# Altium project MB1936.PrjPcb (part 1 of 8)
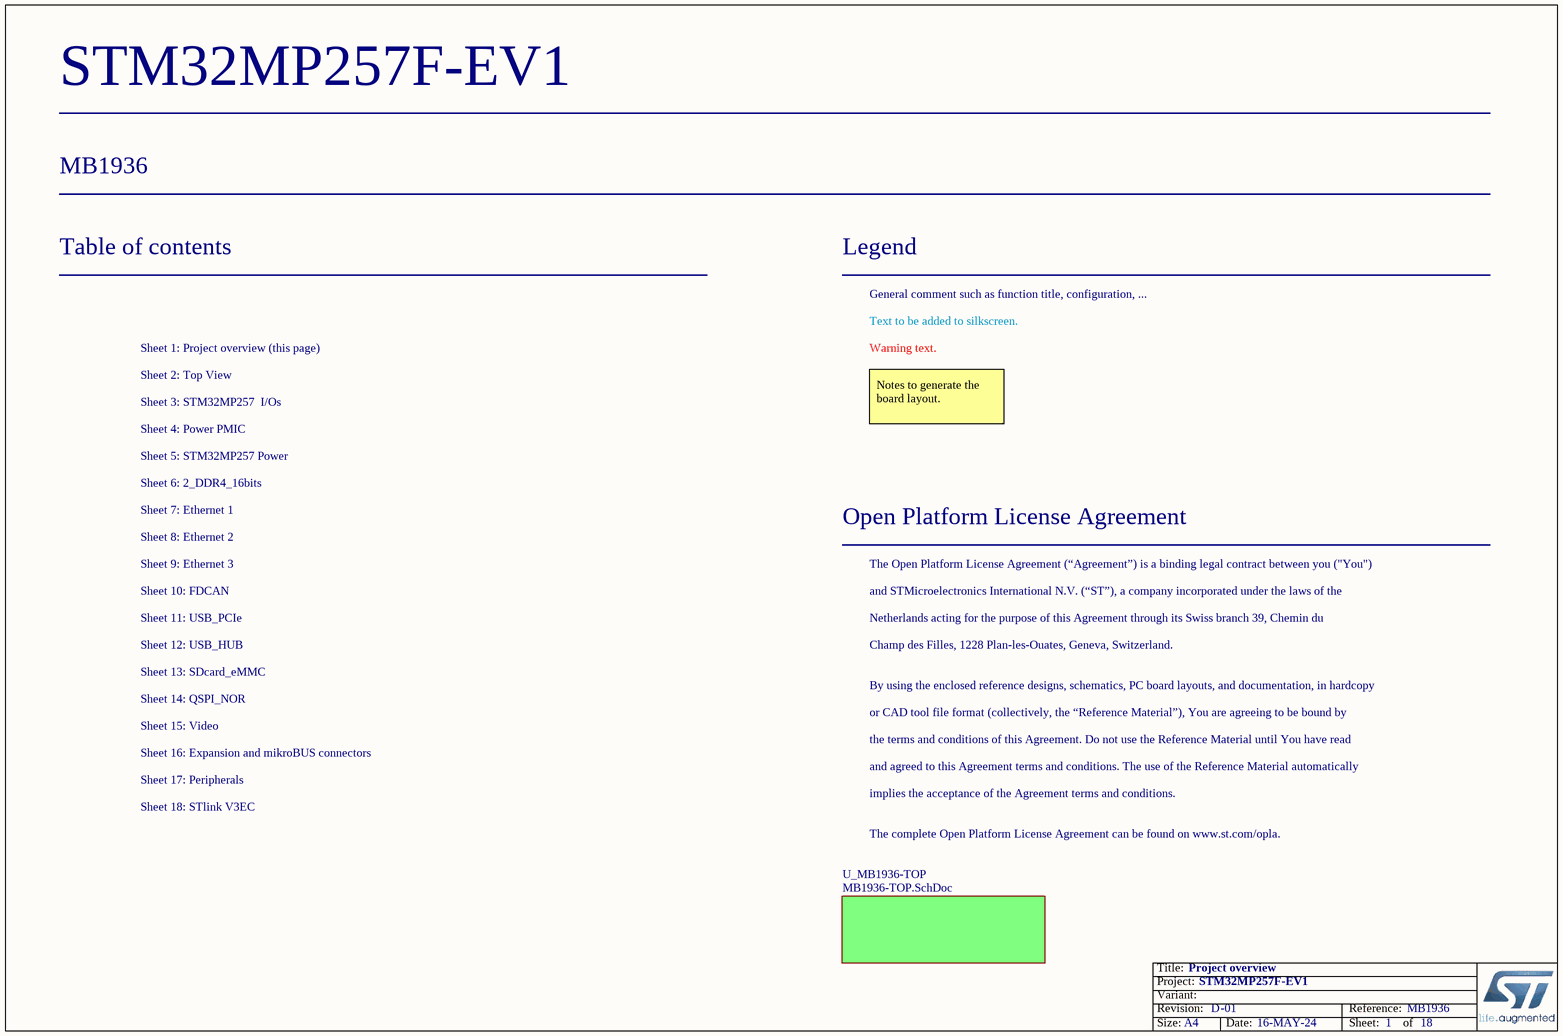
[diagram p0: MB1936_Project_Overview.SchDoc]
Board_Reference: MB1936; Board_PCB_Revision: D; Board_Name: STM32MP257F-EV1; Board_Document_Date: 16-MAY-24; Board_Assembly_Revision: 01
18 sheets, 865 parts. Net scope: flat (ports and power ports of the same name join across sheets).
Board file: MB1936.PcbDoc
Sheets:
  MB1936_Project_Overview.SchDoc
    U_MB1936-TOP = MB1936-TOP.SchDoc
      U_Video = Video.SchDoc
      U_SDcard_eMMC = SDcard_eMMC.SchDoc
      U_MP257_18x18 = MP257_18x18.SchDoc
      U_FDCAN = FDCAN.SchDoc
      U_Ethernet1 = Ethernet1.SchDoc
      U_Ethernet2 = Ethernet2.SchDoc
      U_Ethernet3 = Ethernet3.SchDoc
      U_Peripherals = Peripherals.SchDoc
      U_QSPI_NOR = QSPI_NOR.SchDoc
      U_Power_MPU = Power_MPU.SchDoc
      U_USB_HUB = USB_HUB.SchDoc
      U_2_DDR4_16bits = 2_DDR4_16bits.SchDoc
      U_USB_PCIe = USB_PCIe.SchDoc
      U_STLINK_V3EC = STLINK_V3EC.SchDoc
      U_Power_PMIC = Power_PMIC.SchDoc
      U_Expansion _&_mikroBUS_Connectors = Expansion _&_mikroBUS_Connectors.SchDoc

## Sheet MB1936_Project_Overview.SchDoc: Project overview
size A4; Date: Not used; ApprovedBy: Not used; CheckedBy: Not used; Author: Not used; CompanyName: STMicroelectronics; DrawnBy: Not used; Engineer: Not used; Organization: Not used; Address1: Not used; Address2: Not used; Address3: Not used; Address4: Not used; DocumentNumber: Not used; Revision: Not used; SheetNumber: 1; SheetTotal: 18; CurrentTime: Not used; CurrentDate: Not used; Time: Not used; DocumentFullPathAndName: Not used; DocumentName: Not used; ModifiedDate: Not used; ImagePath: Not used; ProjectName: Not used; Application_BuildNumber: Not used

### Sub-sheets
U_MB1936-TOP = MB1936-TOP.SchDoc: no entries

### Notes on the sheet
- Table of contents
- Legend
- General comment such as function title, configuration, ...
- Sheet 1: Project overview (this page)
- Sheet 2: Top View
- Text to be added to silkscreen.
- Warning text.
- Sheet 3: STM32MP257  I/Os
- Sheet 4: Power PMIC
- Notes to generate the board layout.
- Sheet 5: STM32MP257 Power
- Sheet 7: Ethernet 1
- Sheet 6: 2_DDR4_16bits
- Sheet 8: Ethernet 2
- Sheet 9: Ethernet 3
- Open Platform License Agreement
- The Open Platform License Agreement (“Agreement”) is a binding legal contract between you ("You")
- Sheet 10: FDCAN
- Sheet 11: USB_PCIe
- Sheet 12: USB_HUB
- and STMicroelectronics International N.V. (“ST”), a company incorporated under the laws of the
- Netherlands acting for the purpose of this Agreement through its Swiss branch 39, Chemin du
- Champ des Filles, 1228 Plan-les-Ouates, Geneva, Switzerland.
- Sheet 13: SDcard_eMMC
- Sheet 14: QSPI_NOR
- By using the enclosed reference designs, schematics, PC board layouts, and documentation, in hardcopy
- or CAD tool file format (collectively, the “Reference Material”), You are agreeing to be bound by
- Sheet 17: Peripherals
- Sheet 16: Expansion and mikroBUS connectors
- Sheet 15: Video
- the terms and conditions of this Agreement. Do not use the Reference Material until You have read
- and agreed to this Agreement terms and conditions. The use of the Reference Material automatically
- Sheet 18: STlink V3EC
- implies the acceptance of the Agreement terms and conditions.
- The complete Open Platform License Agreement can be found on www.st.com/opla.
- Title:
- Project:
- Size:
- Revision:
- Variant:
- A4
- -
- Date:
- Reference:
- Sheet:
- of

## Sheet MB1936-TOP.SchDoc: TOP
size A3; Date: Not used; ApprovedBy: Not used; CheckedBy: Not used; Author: Not used; CompanyName: STMicroelectronics; DrawnBy: Not used; Engineer: Not used; Organization: Not used; Address1: Not used; Address2: Not used; Address3: Not used; Address4: Not used; DocumentNumber: Not used; Revision: Not used; SheetNumber: 2; SheetTotal: 18; CurrentTime: Not used; CurrentDate: Not used; Time: Not used; DocumentFullPathAndName: Not used; DocumentName: Not used; ModifiedDate: Not used; ImagePath: Not used; ProjectName: Not used; Application_BuildNumber: Not used
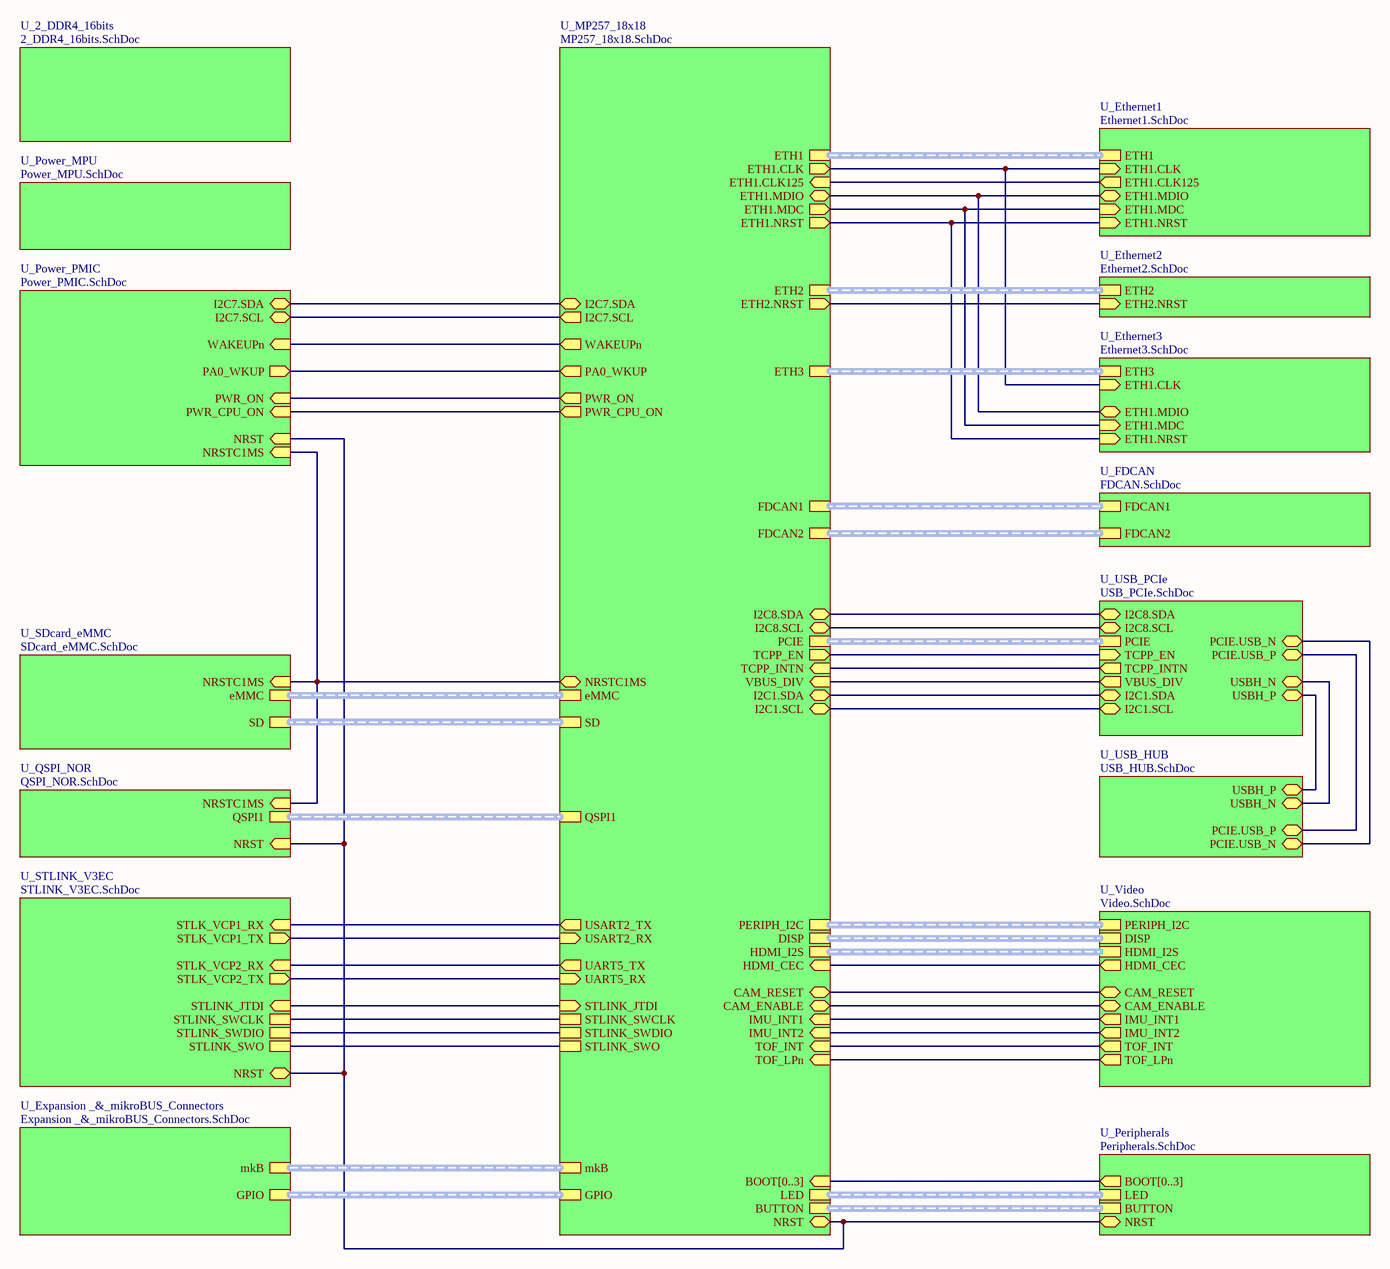
[diagram p1: MB1936-TOP.SchDoc]

### Sub-sheets
U_2_DDR4_16bits = 2_DDR4_16bits.SchDoc: no entries
U_Ethernet1 = Ethernet1.SchDoc: ETH1.NRST (in), ETH1 (harness ETH1), ETH1.CLK (in), ETH1.MDC (in), ETH1.MDIO (bidir), ETH1.CLK125 (out)
U_Ethernet2 = Ethernet2.SchDoc: ETH2.NRST (in), ETH2 (harness ETH2)
U_Ethernet3 = Ethernet3.SchDoc: ETH1.NRST (in), ETH3 (harness ETH3), ETH1.CLK (in), ETH1.MDIO (bidir), ETH1.MDC (in)
U_Expansion _&_mikroBUS_Connectors = Expansion _&_mikroBUS_Connectors.SchDoc: GPIO (harness GPIO), mkB (harness mikroBUS)
U_FDCAN = FDCAN.SchDoc: FDCAN2 (harness FDCAN2), FDCAN1 (harness FDCAN1)
U_MP257_18x18 = MP257_18x18.SchDoc: SD (harness SD), eMMC (harness eMMC), ETH1 (harness ETH1), ETH3 (harness ETH3), HDMI_CEC (in), ETH2 (harness ETH2), ETH1.NRST (out), PWR_ON (out), NRST (bidir), FDCAN1 (harness FDCAN1), FDCAN2 (harness FDCAN2), LED (harness LED), BOOT[0..3] (in), UART5_RX (in), UART5_TX (out), QSPI1 (harness QSPI), GPIO (harness GPIO), HDMI_I2S (harness HDMI_I2S), PERIPH_I2C (harness PERIPH_I2C), TCPP_INTN (in), I2C7.SDA (bidir), USART2_TX (out), I2C7.SCL (out), USART2_RX (in), VBUS_DIV (in), ETH1.MDIO (bidir), ETH1.CLK125 (in), ETH1.MDC (out), ETH1.CLK (out), PCIE (harness PCIE), STLINK_JTDI (in), STLINK_SWCLK, STLINK_SWDIO, STLINK_SWO, DISP (harness DISP), I2C1.SDA (bidir), I2C1.SCL (bidir), NRSTC1MS (bidir), PWR_CPU_ON (out), TOF_INT (in), CAM_ENABLE (bidir), IMU_INT1 (in), IMU_INT2 (in), TOF_LPn (in), CAM_RESET (bidir), ETH2.NRST (out), I2C8.SDA (bidir), I2C8.SCL (bidir), BUTTON (harness BUTTON), PA0_WKUP (out), WAKEUPn (out), mkB (harness mikroBUS), TCPP_EN (out)
U_Peripherals = Peripherals.SchDoc: NRST (bidir), BOOT[0..3] (out), LED (harness LED), BUTTON (harness BUTTON)
U_Power_MPU = Power_MPU.SchDoc: no entries
U_Power_PMIC = Power_PMIC.SchDoc: PWR_CPU_ON (in), NRST (in), PWR_ON (in), I2C7.SDA (bidir), I2C7.SCL (bidir), WAKEUPn (in), NRSTC1MS (in), PA0_WKUP (out)
U_QSPI_NOR = QSPI_NOR.SchDoc: QSPI1 (harness QSPI), NRSTC1MS (in), NRST (in)
U_SDcard_eMMC = SDcard_eMMC.SchDoc: SD (harness SD), NRSTC1MS (in), eMMC (harness eMMC)
U_STLINK_V3EC = STLINK_V3EC.SchDoc: NRST (bidir), STLK_VCP2_TX (out), STLK_VCP2_RX (in), STLK_VCP1_TX (out), STLK_VCP1_RX (in), STLINK_SWCLK, STLINK_SWDIO, STLINK_JTDI (in), STLINK_SWO
U_USB_HUB = USB_HUB.SchDoc: USBH_P (bidir), USBH_N (bidir), PCIE.USB_P (bidir), PCIE.USB_N (bidir)
U_USB_PCIe = USB_PCIe.SchDoc: PCIE (harness PCIE), USBH_P (bidir), USBH_N (bidir), TCPP_INTN (out), I2C1.SDA (bidir), I2C1.SCL (bidir), VBUS_DIV (out), PCIE.USB_N (bidir), PCIE.USB_P (bidir), I2C8.SDA (bidir), I2C8.SCL (bidir), TCPP_EN (in)
U_Video = Video.SchDoc: CAM_RESET (bidir), HDMI_CEC (out), CAM_ENABLE (bidir), HDMI_I2S (harness HDMI_I2S), PERIPH_I2C (harness PERIPH_I2C), DISP (harness DISP), IMU_INT1 (out), TOF_INT (out), TOF_LPn (out), IMU_INT2 (out)

### Nets
(unnamed): sheet U_Video/CAM_RESET, sheet U_MP257_18x18/CAM_RESET
(unnamed): sheet U_Video/HDMI_CEC, sheet U_MP257_18x18/HDMI_CEC
(unnamed): sheet U_Video/CAM_ENABLE, sheet U_MP257_18x18/CAM_ENABLE
(unnamed): sheet U_Video/IMU_INT1, sheet U_MP257_18x18/IMU_INT1
(unnamed): sheet U_Video/TOF_INT, sheet U_MP257_18x18/TOF_INT
(unnamed): sheet U_Video/TOF_LPn, sheet U_MP257_18x18/TOF_LPn
(unnamed): sheet U_Video/IMU_INT2, sheet U_MP257_18x18/IMU_INT2
(unnamed): sheet U_SDcard_eMMC/NRSTC1MS, sheet U_MP257_18x18/NRSTC1MS, sheet U_QSPI_NOR/NRSTC1MS, sheet U_Power_PMIC/NRSTC1MS
(unnamed): sheet U_MP257_18x18/ETH1.NRST, sheet U_Ethernet1/ETH1.NRST, sheet U_Ethernet3/ETH1.NRST
(unnamed): sheet U_MP257_18x18/PWR_ON, sheet U_Power_PMIC/PWR_ON
(unnamed): sheet U_MP257_18x18/NRST, sheet U_Peripherals/NRST, sheet U_QSPI_NOR/NRST, sheet U_STLINK_V3EC/NRST, sheet U_Power_PMIC/NRST
(unnamed): sheet U_MP257_18x18/UART5_RX, sheet U_STLINK_V3EC/STLK_VCP2_TX
(unnamed): sheet U_MP257_18x18/UART5_TX, sheet U_STLINK_V3EC/STLK_VCP2_RX
(unnamed): sheet U_MP257_18x18/TCPP_INTN, sheet U_USB_PCIe/TCPP_INTN
(unnamed): sheet U_MP257_18x18/I2C7.SDA, sheet U_Power_PMIC/I2C7.SDA
(unnamed): sheet U_MP257_18x18/USART2_TX, sheet U_STLINK_V3EC/STLK_VCP1_RX
(unnamed): sheet U_MP257_18x18/I2C7.SCL, sheet U_Power_PMIC/I2C7.SCL
(unnamed): sheet U_MP257_18x18/USART2_RX, sheet U_STLINK_V3EC/STLK_VCP1_TX
(unnamed): sheet U_MP257_18x18/VBUS_DIV, sheet U_USB_PCIe/VBUS_DIV
(unnamed): sheet U_MP257_18x18/ETH1.MDIO, sheet U_Ethernet1/ETH1.MDIO, sheet U_Ethernet3/ETH1.MDIO
(unnamed): sheet U_MP257_18x18/ETH1.CLK125, sheet U_Ethernet1/ETH1.CLK125
(unnamed): sheet U_MP257_18x18/ETH1.MDC, sheet U_Ethernet1/ETH1.MDC, sheet U_Ethernet3/ETH1.MDC
(unnamed): sheet U_MP257_18x18/ETH1.CLK, sheet U_Ethernet1/ETH1.CLK, sheet U_Ethernet3/ETH1.CLK
(unnamed): sheet U_MP257_18x18/STLINK_JTDI, sheet U_STLINK_V3EC/STLINK_JTDI
(unnamed): sheet U_MP257_18x18/STLINK_SWCLK, sheet U_STLINK_V3EC/STLINK_SWCLK
(unnamed): sheet U_MP257_18x18/STLINK_SWDIO, sheet U_STLINK_V3EC/STLINK_SWDIO
(unnamed): sheet U_MP257_18x18/STLINK_SWO, sheet U_STLINK_V3EC/STLINK_SWO
(unnamed): sheet U_MP257_18x18/I2C1.SDA, sheet U_USB_PCIe/I2C1.SDA
(unnamed): sheet U_MP257_18x18/I2C1.SCL, sheet U_USB_PCIe/I2C1.SCL
(unnamed): sheet U_MP257_18x18/PWR_CPU_ON, sheet U_Power_PMIC/PWR_CPU_ON
(unnamed): sheet U_MP257_18x18/ETH2.NRST, sheet U_Ethernet2/ETH2.NRST
(unnamed): sheet U_MP257_18x18/I2C8.SDA, sheet U_USB_PCIe/I2C8.SDA
(unnamed): sheet U_MP257_18x18/I2C8.SCL, sheet U_USB_PCIe/I2C8.SCL
(unnamed): sheet U_MP257_18x18/PA0_WKUP, sheet U_Power_PMIC/PA0_WKUP
(unnamed): sheet U_MP257_18x18/WAKEUPn, sheet U_Power_PMIC/WAKEUPn
(unnamed): sheet U_MP257_18x18/TCPP_EN, sheet U_USB_PCIe/TCPP_EN
(unnamed): sheet U_USB_HUB/USBH_P, sheet U_USB_PCIe/USBH_P
(unnamed): sheet U_USB_HUB/USBH_N, sheet U_USB_PCIe/USBH_N
(unnamed): sheet U_USB_HUB/PCIE.USB_P, sheet U_USB_PCIe/PCIE.USB_P
(unnamed): sheet U_USB_HUB/PCIE.USB_N, sheet U_USB_PCIe/PCIE.USB_N

### Buses and harness runs
bus sheet U_MP257_18x18/BOOT[0..3] = sheet U_Peripherals/BOOT[0..3]
harness sheet U_Ethernet1/ETH1 = sheet U_MP257_18x18/ETH1
harness sheet U_Ethernet2/ETH2 = sheet U_MP257_18x18/ETH2
harness sheet U_Ethernet3/ETH3 = sheet U_MP257_18x18/ETH3
harness sheet U_Expansion _&_mikroBUS_Connectors/GPIO = sheet U_MP257_18x18/GPIO
harness sheet U_Expansion _&_mikroBUS_Connectors/mkB = sheet U_MP257_18x18/mkB
harness sheet U_FDCAN/FDCAN1 = sheet U_MP257_18x18/FDCAN1
harness sheet U_FDCAN/FDCAN2 = sheet U_MP257_18x18/FDCAN2
harness sheet U_MP257_18x18/BUTTON = sheet U_Peripherals/BUTTON
harness sheet U_MP257_18x18/DISP = sheet U_Video/DISP
harness sheet U_MP257_18x18/eMMC = sheet U_SDcard_eMMC/eMMC
harness sheet U_MP257_18x18/HDMI_I2S = sheet U_Video/HDMI_I2S
harness sheet U_MP257_18x18/LED = sheet U_Peripherals/LED
harness sheet U_MP257_18x18/PCIE = sheet U_USB_PCIe/PCIE
harness sheet U_MP257_18x18/PERIPH_I2C = sheet U_Video/PERIPH_I2C
harness sheet U_MP257_18x18/QSPI1 = sheet U_QSPI_NOR/QSPI1
harness sheet U_MP257_18x18/SD = sheet U_SDcard_eMMC/SD

### Notes on the sheet
- Title:
- Project:
- Size:
- Revision:
- Variant:
- A3
- -
- Date:
- Reference:
- Sheet:
- of

## Sheet Video.SchDoc: VIDEO
size A3; Date: Not used; ApprovedBy: Not used; CheckedBy: Not used; Author: Not used; CompanyName: STMicroelectronics; DrawnBy: Not used; Engineer: Not used; Organization: Not used; Address1: Not used; Address2: Not used; Address3: Not used; Address4: Not used; DocumentNumber: Not used; Revision: Not used; SheetNumber: 15; SheetTotal: 18; CurrentTime: Not used; CurrentDate: Not used; Time: Not used; DocumentFullPathAndName: Not used; DocumentName: Not used; ModifiedDate: Not used; ImagePath: Not used; ProjectName: Not used; Application_BuildNumber: Not used
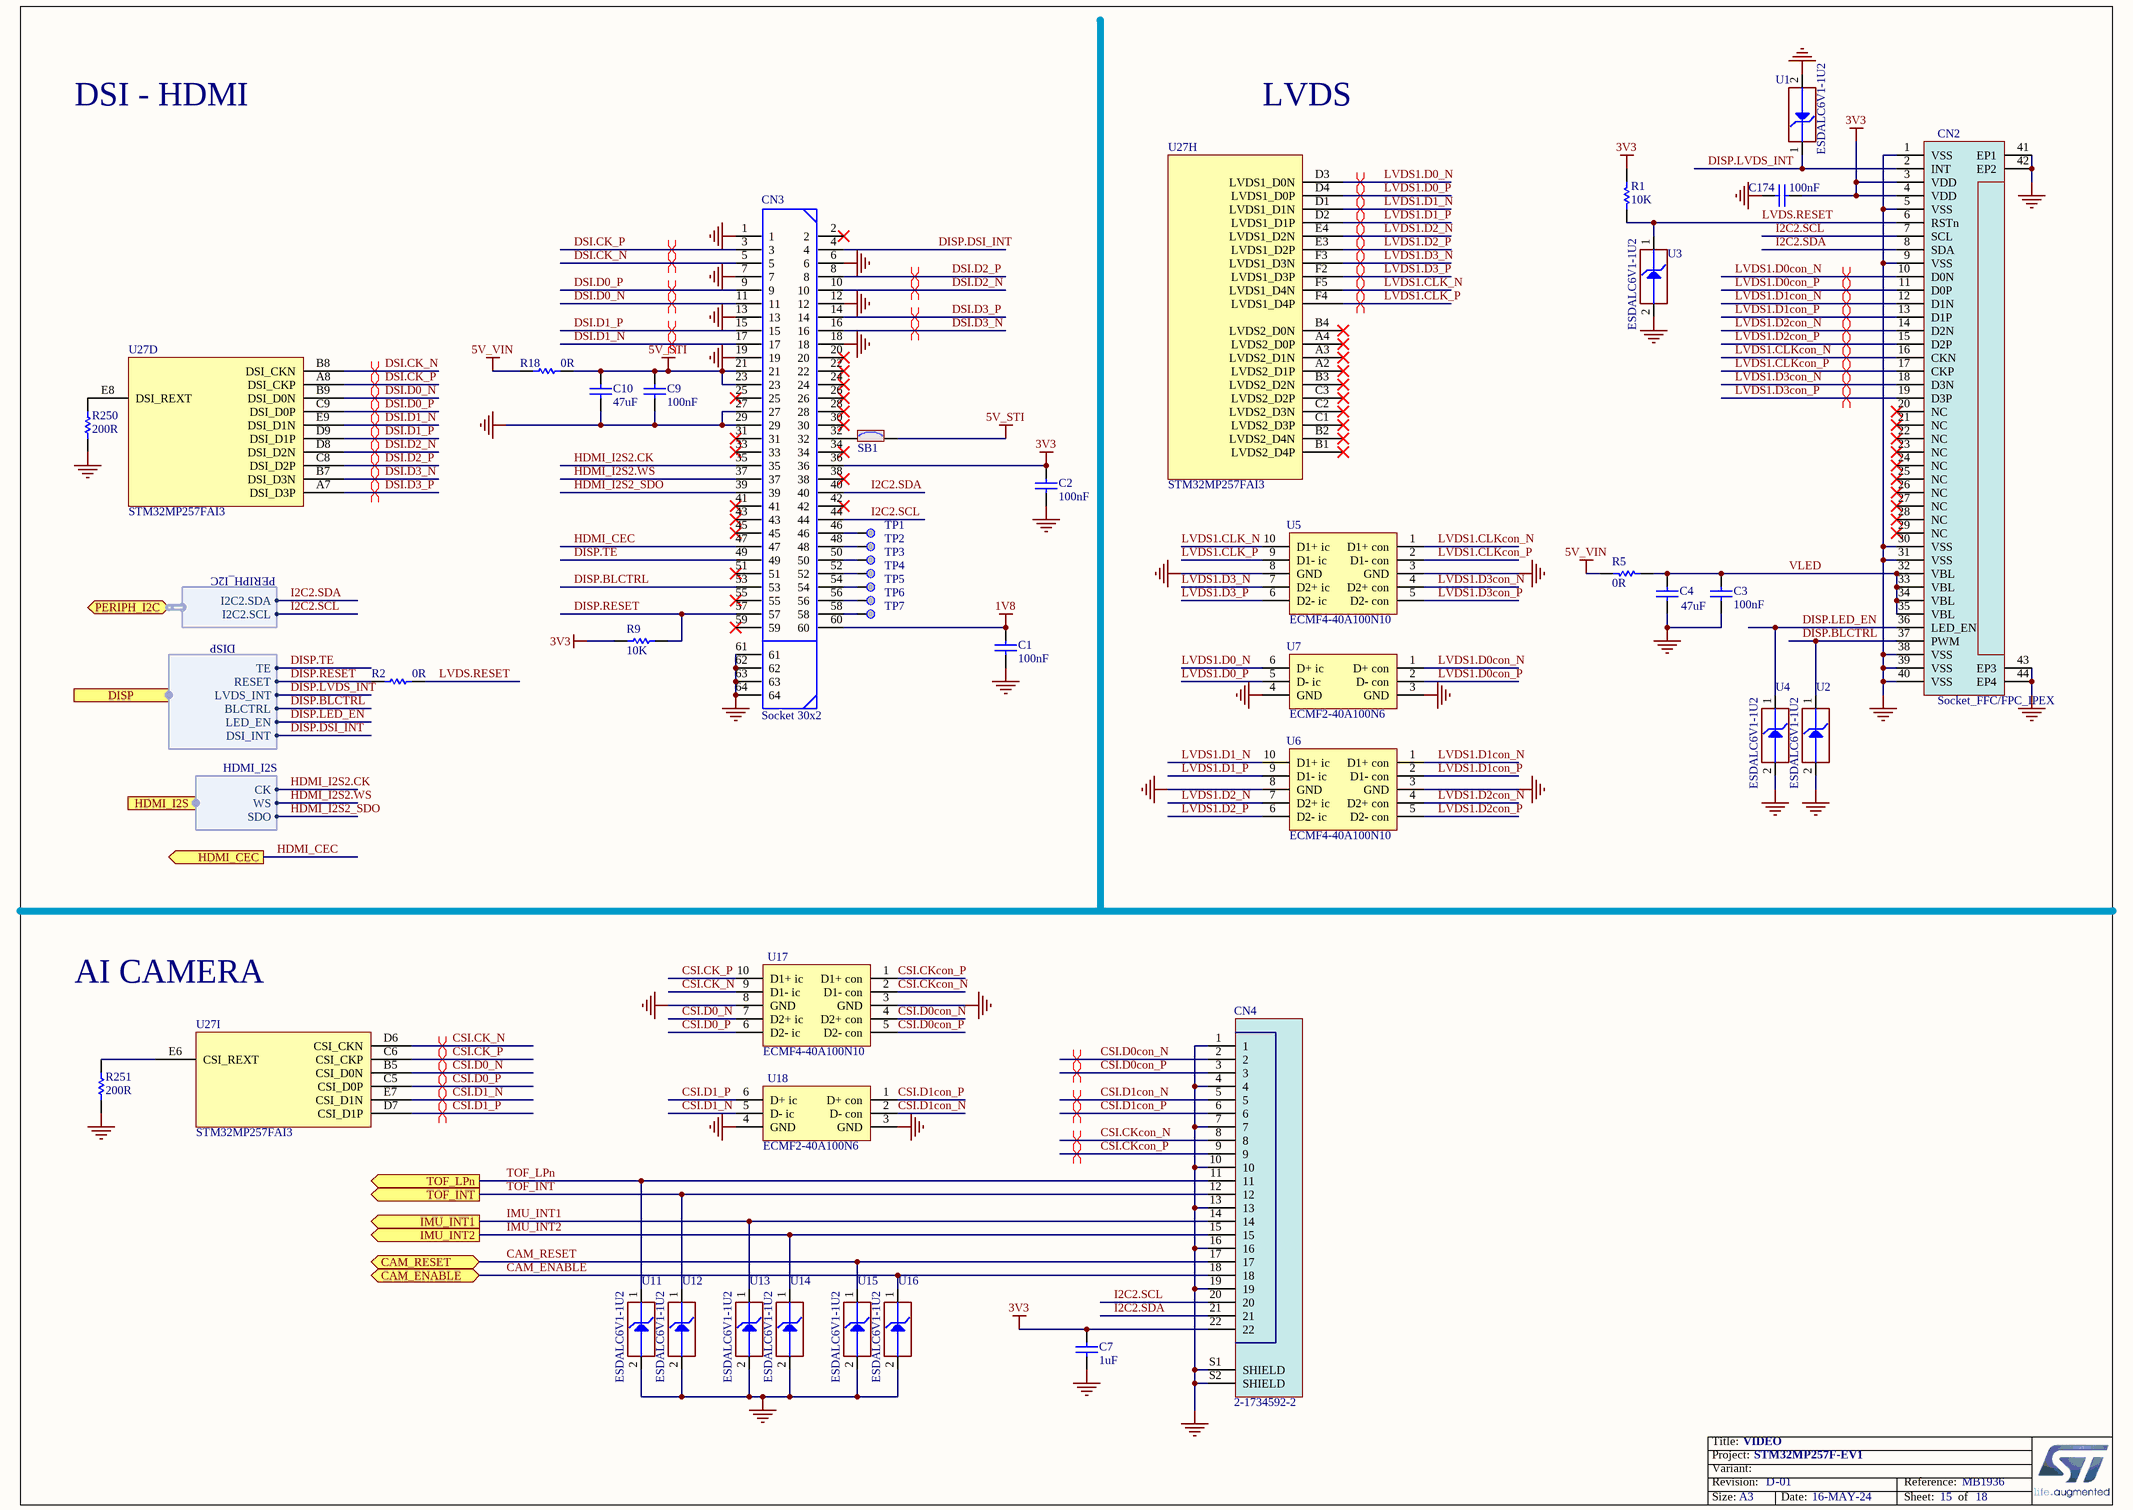
[diagram p2: Video.SchDoc]

### Parts
C1  value 100nF  [C0402]  (hidden comment: Capacitor)
C2  value 100nF  [C0402]  (hidden comment: Capacitor)
C3  value 100nF  [C0402]  (hidden comment: Capacitor)
C4  value 47uF  [C0805]  (hidden comment: Capacitor)
C7  value 1uF  [C0402]  (hidden comment: Capacitor)
C9  value 100nF  [C0402]  (hidden comment: Capacitor)
C10  value 47uF  [C0805]  (hidden comment: Capacitor)
C174  value 100nF  [C0402]  (hidden comment: Capacitor)
CN2  value Socket_FFC/FPC_IPEX  [CON_I-PEX_20455-040E-76]  (hidden comment: IPEX20455)
CN3  value Socket 30x2  [CON_SAMTEC_QSH-030-01-F-D-A]  (hidden comment: Socket QSH-030-01-F-D-A)
CN4  2-1734592-2  [CON_TE-CONNECTIVITY_2-1734592-2_INV]
R1  value 10K  [R0402]  (hidden comment: Resistor)
R2  value 0R  [R0402]  (hidden comment: Resistor)
R5  value 0R  [R0805]  (hidden comment: Resistor)
R9  value 10K  [R0402]  (hidden comment: Resistor)
R18  value 0R  [R0402]  (hidden comment: Resistor)
R250  value 200R  [R0402]  (hidden comment: Resistor)
R251  value 200R  [R0402]  (hidden comment: Resistor)
SB1  SB_ON  [SOLDER-BRIDGE_R0603-0R]  (value not drawn)
TP1  Test Point  [TP_SMD_1MM]  (value not drawn)  (no BOM)
TP2  Test Point  [TP_SMD_1MM]  (value not drawn)  (no BOM)
TP3  Test Point  [TP_SMD_1MM]  (value not drawn)  (no BOM)
TP4  Test Point  [TP_SMD_1MM]  (value not drawn)  (no BOM)
TP5  Test Point  [TP_SMD_1MM]  (value not drawn)  (no BOM)
TP6  Test Point  [TP_SMD_1MM]  (value not drawn)  (no BOM)
TP7  Test Point  [TP_SMD_1MM]  (value not drawn)  (no BOM)
U1  value ESDALC6V1-1U2  [ESD_ST0201]  (hidden comment: ESD-TRANSIL)
U2  value ESDALC6V1-1U2  [ESD_ST0201]  (hidden comment: ESD-TRANSIL)
U3  value ESDALC6V1-1U2  [ESD_ST0201]  (hidden comment: ESD-TRANSIL)
U4  value ESDALC6V1-1U2  [ESD_ST0201]  (hidden comment: ESD-TRANSIL)
U5  ECMF4-40A100N10  [ESD_UQFN-10L_2P25X1P4_P040]
U6  ECMF4-40A100N10  [ESD_UQFN-10L_2P25X1P4_P040]
U7  ECMF2-40A100N6  [ESD_UQFN-6L_1P45X1P4_P040]
U11  value ESDALC6V1-1U2  [ESD_ST0201]  (hidden comment: ESD-TRANSIL)
U12  value ESDALC6V1-1U2  [ESD_ST0201]  (hidden comment: ESD-TRANSIL)
U13  value ESDALC6V1-1U2  [ESD_ST0201]  (hidden comment: ESD-TRANSIL)
U14  value ESDALC6V1-1U2  [ESD_ST0201]  (hidden comment: ESD-TRANSIL)
U15  value ESDALC6V1-1U2  [ESD_ST0201]  (hidden comment: ESD-TRANSIL)
U16  value ESDALC6V1-1U2  [ESD_ST0201]  (hidden comment: ESD-TRANSIL)
U17  ECMF4-40A100N10  [ESD_UQFN-10L_2P25X1P4_P040]
U18  ECMF2-40A100N6  [ESD_UQFN-6L_1P45X1P4_P040]
U27  STM32MP257FAI3  [ICC_LFBGA436_18X18_P080_H1P70_STM32MP257_CODE-B0D1]  (parts D,H,I of 9)

### Ports
CAM_ENABLE (bidir), CAM_RESET (bidir), DISP (harness DISP), HDMI_CEC (out), HDMI_I2S (harness HDMI_I2S), IMU_INT1 (out), IMU_INT2 (out), PERIPH_I2C (bidir, harness PERIPH_I2C), TOF_INT (out), TOF_LPn (out)

### Harnesses
DISP: RESET, TE, LVDS_INT, BLCTRL, LED_EN, DSI_INT
HDMI_I2S: CK, SDO, WS
PERIPH_I2C: I2C2.SDA, I2C2.SCL

### Nets
1V8: C1.2 CN3.60
3V3: C2.2 C7.2 C174.2 CN2.3(VDD) CN2.4(VDD) CN3.36 CN4.22 R1.1 R9.1
5V_STI: C9.2 C10.2 CN3.21 CN3.23 R18.2 SB1.2
5V_VIN: R5.2 R18.1
GND: C1.1 C2.1 C3.1 C4.1 C7.1 C9.1 C10.1 C174.1 CN2.1(VSS) CN2.5(VSS) CN2.9(VSS) CN2.30(VSS) CN2.31(VSS) CN2.38(VSS) CN2.39(VSS) CN2.40(VSS) CN2.41(EP1) CN2.42(EP2) CN2.43(EP3) CN2.44(EP4) CN3.1 CN3.6 CN3.7 CN3.12 CN3.13 CN3.18 CN3.19 CN3.27 CN3.29 CN3.61 CN3.62 CN3.63 CN3.64 CN4.1 CN4.4 CN4.7 CN4.10 CN4.13 CN4.16 CN4.19 CN4.S1(SHIELD) CN4.S2(SHIELD) R250.2 R251.2 U1.2(GND) U2.2(GND) U3.2(GND) U4.2(GND) U5.3(GND) U5.8(GND) U6.3(GND) U6.8(GND) U7.3(GND) U7.4(GND) U11.2(GND) U12.2(GND) U13.2(GND) U14.2(GND) U15.2(GND) U16.2(GND) U17.3(GND) U17.8(GND) U18.3(GND) U18.4(GND)
CAM_ENABLE: CN4.18 U16.1(IO1) ; port CAM_ENABLE
CAM_RESET: CN4.17 U15.1(IO1) ; port CAM_RESET
CSI.CK_N: U17.9(D1-_ic) U27.D6(CSI_CKN)
CSI.CK_P: U17.10(D1+_ic) U27.C6(CSI_CKP)
CSI.CKcon_N: CN4.8 U17.2(D1-_con)
CSI.CKcon_P: CN4.9 U17.1(D1+_con)
CSI.D0_N: U17.7(D2+_ic) U27.B5(CSI_D0N)
CSI.D0_P: U17.6(D2-_ic) U27.C5(CSI_D0P)
CSI.D0con_N: CN4.2 U17.4(D2+_con)
CSI.D0con_P: CN4.3 U17.5(D2-_con)
CSI.D1_N: U18.5(D-_ic) U27.E7(CSI_D1N)
CSI.D1_P: U18.6(D+_ic) U27.D7(CSI_D1P)
CSI.D1con_N: CN4.5 U18.2(D-_con)
CSI.D1con_P: CN4.6 U18.1(D+_con)
DISP.BLCTRL: CN2.37(PWM) CN3.53 U2.1(IO1) ; port DISP.BLCTRL
DISP.DSI_INT: CN3.4 ; port DISP.DSI_INT
DISP.LED_EN: CN2.36(LED_EN) U4.1(IO1) ; port DISP.LED_EN
DISP.LVDS_INT: CN2.2(INT) U1.1(IO1) ; port DISP.LVDS_INT
DISP.RESET: CN3.57 R2.1 R9.2 ; port DISP.RESET
DISP.TE: CN3.49 ; port DISP.TE
DSI.CK_N: CN3.5 U27.B8(DSI_CKN)
DSI.CK_P: CN3.3 U27.A8(DSI_CKP)
DSI.D0_N: CN3.11 U27.B9(DSI_D0N)
DSI.D0_P: CN3.9 U27.C9(DSI_D0P)
DSI.D1_N: CN3.17 U27.E9(DSI_D1N)
DSI.D1_P: CN3.15 U27.D9(DSI_D1P)
DSI.D2_N: CN3.10 U27.D8(DSI_D2N)
DSI.D2_P: CN3.8 U27.C8(DSI_D2P)
DSI.D3_N: CN3.16 U27.B7(DSI_D3N)
DSI.D3_P: CN3.14 U27.A7(DSI_D3P)
HDMI_CEC: CN3.47 ; port HDMI_CEC
HDMI_I2S2.CK: CN3.35 ; port HDMI_I2S.CK
HDMI_I2S2.WS: CN3.37 ; port HDMI_I2S.WS
HDMI_I2S2_SDO: CN3.39 ; port HDMI_I2S.SDO
I2C2.SCL: CN2.7(SCL) CN3.44 CN4.20 ; port PERIPH_I2C.I2C2.SCL
I2C2.SDA: CN2.8(SDA) CN3.40 CN4.21 ; port PERIPH_I2C.I2C2.SDA
IMU_INT1: CN4.14 U13.1(IO1) ; port IMU_INT1
IMU_INT2: CN4.15 U14.1(IO1) ; port IMU_INT2
LVDS1.CLK_N: U5.10(D1+_ic) U27.F5(LVDS1_D4N)
LVDS1.CLK_P: U5.9(D1-_ic) U27.F4(LVDS1_D4P)
LVDS1.CLKcon_N: CN2.16(CKN) U5.1(D1+_con)
LVDS1.CLKcon_P: CN2.17(CKP) U5.2(D1-_con)
LVDS1.D0_N: U7.6(D+_ic) U27.D3(LVDS1_D0N)
LVDS1.D0_P: U7.5(D-_ic) U27.D4(LVDS1_D0P)
LVDS1.D0con_N: CN2.10(D0N) U7.1(D+_con)
LVDS1.D0con_P: CN2.11(D0P) U7.2(D-_con)
LVDS1.D1_N: U6.10(D1+_ic) U27.D1(LVDS1_D1N)
LVDS1.D1_P: U6.9(D1-_ic) U27.D2(LVDS1_D1P)
LVDS1.D1con_N: CN2.12(D1N) U6.1(D1+_con)
LVDS1.D1con_P: CN2.13(D1P) U6.2(D1-_con)
LVDS1.D2_N: U6.7(D2+_ic) U27.E4(LVDS1_D2N)
LVDS1.D2_P: U6.6(D2-_ic) U27.E3(LVDS1_D2P)
LVDS1.D2con_N: CN2.14(D2N) U6.4(D2+_con)
LVDS1.D2con_P: CN2.15(D2P) U6.5(D2-_con)
LVDS1.D3_N: U5.7(D2+_ic) U27.F3(LVDS1_D3N)
LVDS1.D3_P: U5.6(D2-_ic) U27.F2(LVDS1_D3P)
LVDS1.D3con_N: CN2.18(D3N) U5.4(D2+_con)
LVDS1.D3con_P: CN2.19(D3P) U5.5(D2-_con)
LVDS.RESET: CN2.6(RSTn) R1.2 R2.2 U3.1(IO1)
TOF_INT: CN4.12 U12.1(IO1) ; port TOF_INT
TOF_LPn: CN4.11 U11.1(IO1) ; port TOF_LPn
VLED: C3.2 C4.2 CN2.32(VBL) CN2.33(VBL) CN2.34(VBL) CN2.35(VBL) R5.1
NetCN3_32: CN3.32 SB1.1
NetCN3_46: CN3.46 TP1.1
NetCN3_48: CN3.48 TP2.1
NetCN3_50: CN3.50 TP3.1
NetCN3_52: CN3.52 TP4.1
NetCN3_54: CN3.54 TP5.1
NetCN3_56: CN3.56 TP6.1
NetCN3_58: CN3.58 TP7.1
NetR250_1: R250.1 U27.E8(DSI_REXT)
NetR251_1: R251.1 U27.E6(CSI_REXT)

Not connected (* = marked no-connect by the designer): CN2 20(NC)* 21(NC)* 22(NC)* 23(NC)* 24(NC)* 25(NC)* 26(NC)* 27(NC)* 28(NC)* 29(NC)*; CN3 2* 20* 22* 24* 25* 26* 28* 30* 31* 33* 34* 38* 41* 42* 43* 45* 51* 55* 59*; U27 A2(LVDS2_D1P)* A3(LVDS2_D1N)* A4(LVDS2_D0P)* B1(LVDS2_D4P)* B2(LVDS2_D4N)* B3(LVDS2_D2N)* B4(LVDS2_D0N)* C1(LVDS2_D3P)* C2(LVDS2_D3N)* C3(LVDS2_D2P)*

### Layout directives
differential pair: CSI.CK_N, CSI.CK_P, CSI.CKcon_N, CSI.CKcon_P, CSI.D0_N, CSI.D0_P, CSI.D0con_N, CSI.D0con_P, CSI.D1_N, CSI.D1_P, CSI.D1con_N, CSI.D1con_P, DSI.CK_N, DSI.CK_P, DSI.D0_N, DSI.D0_P, DSI.D1_N, DSI.D1_P, DSI.D2_N, DSI.D2_P, DSI.D3_N, DSI.D3_P, LVDS1.CLK_N, LVDS1.CLK_P, LVDS1.CLKcon_N, LVDS1.CLKcon_P, LVDS1.D0_N, LVDS1.D0_P, LVDS1.D0con_N, LVDS1.D0con_P, LVDS1.D1_N, LVDS1.D1_P, LVDS1.D1con_N, LVDS1.D1con_P, LVDS1.D2_N, LVDS1.D2_P, LVDS1.D2con_N, LVDS1.D2con_P, LVDS1.D3_N, LVDS1.D3_P, LVDS1.D3con_N, LVDS1.D3con_P

### Notes on the sheet
- DSI - HDMI
- LVDS
- AI CAMERA
- Title:
- Project:
- Size:
- Revision:
- Variant:
- A3
- -
- Date:
- Reference:
- Sheet:
- of

### Library data of the parts
C1-C3 C9 C174 = MCD-02352: Capacitor, MLCC, 100nF, 10V, X5R, +/-10%, 0402, T=0,5mm; Part_Preference: Recommended; Manufacturer: YAGEO; Manufacturer_Part_Number: CC0402KRX5R6BB104; Component_Country_Of_Origin: China; ShowFields: YES; ID: 4458; Internal_Part_Number: MCD-02352; Status: Checked; Part_Type: Capacitor; Package: 0402; ComponentLink1URL: http://tunmcdsvn.tun.st.com/Component_Documentation_Library/Trunk/Capacitor/YAGEO_X5R_Series; Order_Code_Digikey: 311-1336-2-ND; Order_Code_Farnell: 2370637; Order_Code_RS: N/A
C4 C10 = MCD-00204: Capacitor, MLCC, 47uF, 10V, X5R, +/-20%, 0805, T=1.25mm; Part_Preference: Recommended; Manufacturer: MURATA; Manufacturer_Part_Number: GRM21BR61A476ME15K; Component_Country_Of_Origin: Japan; ShowFields: YES; ID: 2664; Internal_Part_Number: MCD-00204; Status: Checked; Part_Type: Capacitor; Package: 0805; ComponentLink1URL: http://tunmcdsvn.tun.st.com/Component_Documentation_Library/Trunk/Capacitor/MURATA_GRM_Series; Order_Code_Digikey: GRM21BR61A476ME15K-ND; Order_Code_Farnell: N/A; Order_Code_RS: N/A
C7 = MCD-00095: Capacitor, MLCC, 1uF, 25V, X5R, +/-10%, 0402, T=0,5mm; Manufacturer_Part_Number: GRM155R61E105KA12; Manufacturer: MURATA; Part_Preference: Recommended; Alternate_Manufacturer_Part_Number: GRM155R60J105KE19; Order_Code_RS: 846-7287; Internal_Part_Number: MCD-00095; Status: Released; Part_Type: Capacitor; Package: C0402; ComponentLink1Description: Datasheet; ComponentLink1URL: http://tunmcdsvn.tun.st.com/Component_Datasheet_Library/Trunk/Capacitors/Murata_Capacitor_GR_series; Order_Code_Digikey: 490-10017-1-ND; Order_Code_Farnell: 2218855; Alternate_Manufacturer: MURATA
CN2 = MCD-03562: Socket_FFC/FPC, 40pins, 0.5mm, RA, SMD, T=1mm; Part_Type: Connector; Part_Preference: Recommended; Manufacturer: I-PEX; Manufacturer_Part_Number: 20455-040E-76; Full_Alternate_Internal_Part_Number: MCD-02298; Component_Country_Of_Origin: Unknown; ShowFields: YES; ID: 5678; Internal_Part_Number: MCD-03562; Status: New; ComponentLink1URL: http://tunmcdsvn.tun.st.com/Component_Documentation_Library/Trunk/Connector/I-PEX_20455-040E-76; Order_Code_Digikey: 3508-20455-040E-76TR-ND; Order_Code_Farnell: N/A; Order_Code_RS: N/A
CN3 = MCD-00137: Socket, 30x2, 0.5mm, VR, SMD, T=3.05mm; BMS_Part_Number: 9183715; Part_Preference: Recommended; Part_Type: Connector; Manufacturer: SAMTEC; Component_Country_Of_Origin: China, Costa Rica, Malaysia, United States, Vietnam; ID: 2732; Order_Code_RS: 180-2952; ShowFields: YES; Internal_Part_Number: MCD-00137; Status: Released; Manufacturer_Part_Number: QSH-030-01-F-D-A; ComponentLink1URL: http://tunmcdsvn.tun.st.com/Component_Documentation_Library/Trunk/Connector/SAMTEC_QSH_Series/; Order_Code_Digikey: SAM10650-ND; Order_Code_Farnell: 2779330
CN4 = MCD-03600: Socket_FFC/FPC, 22pins, 0.5mm, RA, SMD, T=2mm; Part_Type: Connector; Part_Preference: Recommended; Manufacturer: TE CONNECTIVITY; Component_Country_Of_Origin: China°; ShowFields: YES; ID: 5716; ComponentLink1URL: http://tunmcdsvn.tun.st.com/Component_Documentation_Library/Trunk/Connector/TE_CONNECTIVITY_2-1734592-2; Internal_Part_Number: MCD-03600; Value: 2-1734592-2; Status: New; Manufacturer_Part_Number: 2-1734592-2; Order_Code_Digikey: A101307TR-ND; Order_Code_Farnell: 3398660; Order_Code_RS: N/A
R1 R9 = MCD-00053: Resistor, 10K, 0402, +/-1%, 1/16W; BMS_Part_Number: 9131590; Part_Preference: Recommended; Manufacturer: YAGEO; Manufacturer_Part_Number: RC0402FR-0710KL; Component_Country_Of_Origin: China; ID: 2539; ShowFields: YES; Internal_Part_Number: MCD-00053; Status: Released; Part_Type: Resistor; Package: 0402; ComponentLink1URL: http://tunmcdsvn.tun.st.com/Component_Documentation_Library/Trunk/Resistor/YAGEO_RC_L_Series; Order_Code_Digikey: 311-10.0KLRCT-ND; Order_Code_Farnell: 9239359; Order_Code_RS: N/A
R2 R18 = MCD-00052: Resistor, 0R, 0402, +/-5%, 1/16W; Part_Preference: Recommended; Manufacturer: YAGEO; Manufacturer_Part_Number: RC0402JR-070RL; Order_Code_RS: 618-5804; Component_Country_Of_Origin: China; ID: 2540; ShowFields: YES; Internal_Part_Number: MCD-00052; Status: Released; Part_Type: Resistor; Package: 0402; ComponentLink1URL: http://tunmcdsvn.tun.st.com/Component_Documentation_Library/Trunk/Resistor/YAGEO_RC_L_Series; Order_Code_Digikey: 311-0.0JRCT-ND; Order_Code_Farnell: 9232516RL
R5 = MCD-00179: Resistor, 0R, 0805, +/-5%, 1/8W; Part_Preference: Recommended; Manufacturer: YAGEO; Manufacturer_Part_Number: RC0805JR-070RL; Component_Country_Of_Origin: China; ID: 2685; ShowFields: YES; Internal_Part_Number: MCD-00179; Status: Released; Part_Type: Resistor; Package: 0805; ComponentLink1URL: http://tunmcdsvn.tun.st.com/Component_Documentation_Library/Trunk/Resistor/YAGEO_RC_L_Series; Order_Code_Digikey: 311-0.0ARCT-ND; Order_Code_Farnell: 9233750; Order_Code_RS: N/A
R250 R251 = MCD-00417: Resistor, 200R, 0402, +/-1%, 1/16W; Manufacturer_Part_Number: RC0402FR-07200RL; Manufacturer: YAGEO; Part_Preference: Recommended; Component_Country_Of_Origin: China; ID: 2860; ShowFields: YES; Internal_Part_Number: MCD-00417; Status: Released; Part_Type: Resistor; Package: 0402; ComponentLink1URL: http://tunmcdsvn.tun.st.com/Component_Documentation_Library/Trunk/Resistor/YAGEO_RC_L_Series; Order_Code_Digikey: 311-200LRCT-ND; Order_Code_Farnell: 1458756; Order_Code_RS: N/A
SB1 = MCD-00071: Solder Bridge ON; Part_Preference: Recommended; Part_Type: Misc; Manufacturer: YAGEO; Manufacturer_Part_Number: RC0603JR-070RL; ID: 2521; ShowFields: YES; Internal_Part_Number: MCD-00071; Status: Released; Package: SB0603; ComponentLink1URL: http://tunmcdsvn.tun.st.com/Component_Datasheet_Library/Trunk/Resistors/Yageo_Resistor_RC0603-series
TP1-TP7 = MCD-00074: Test Point 1mm; Part_Preference: Recommended; Part_Type: Misc; ID: 2518; ShowFields: YES; Internal_Part_Number: MCD-00074; Status: Released; Manufacturer: N/A; Manufacturer_Part_Number: n/a; ComponentLink1URL: http://na; Order_Code_Digikey: N/A; Order_Code_Farnell: N/A; Order_Code_RS: N/A
U1-U4 U11-U16 = MCD-00170: ESD protection 6V1; BMS_Part_Number: 9151132; Part_Type: Diode; Part_Preference: Recommended; Manufacturer: STMICROELECTRONICS; Manufacturer_HQ_COO: EU; Component_Country_Of_Origin: China; ShowFields: YES; ID: 2696; Internal_Part_Number: MCD-00170; Status: Released; Manufacturer_Part_Number: ESDALC6V1-1U2; ComponentLink1URL: http://tunmcdsvn.tun.st.com/Component_Datasheet_Library/Trunk/Diodes/STM_ESD_ESDALC6V1-1U2
U5 U6 U17 = MCD-03059: ESD protection & Common Filter High Speed serial Interfaces , 0.4 pitch; Part_Type: IC; Part_Preference: Recommended; Manufacturer: STMICROELECTRONICS; ShowFields: YES; ID: 5175; Component_Country_Of_Origin: China; ComponentLink1Description: Datasheet; ComponentLink1URL: http://tunmcdsvn.tun.st.com/Component_Documentation_Library/Trunk/IC/STMICROELECTRONICS_ECMF4-40A100N10; Internal_Part_Number: MCD-03059; Value: ECMF4-40A100N10; Status: Checked; Manufacturer_Part_Number: ECMF4-40A100N10; Package: uQFN-10L; Order_Code_Digikey: 497-ECMF4-40A100N10; Order_Code_Farnell: N/A; Order_Code_RS: N/A
U7 U18 = MCD-03060: ESD protection & Common Filter High Speed serial Interfaces , 0.4 pitch; Part_Type: IC; Part_Preference: Recommended; Manufacturer: STMICROELECTRONICS; ShowFields: YES; ID: 5176; Component_Country_Of_Origin: China; ComponentLink1Description: Datasheet; ComponentLink1URL: http://tunmcdsvn.tun.st.com/Component_Documentation_Library/Trunk/IC/STMICROELECTRONICS_ECMF4-40A100N10; Internal_Part_Number: MCD-03060; Value: ECMF2-40A100N6; Status: Checked; Manufacturer_Part_Number: ECMF2-40A100N6; Package: uQFN-6; Order_Code_Digikey: 497-ECMF2-40A100N6; Order_Code_Farnell: 3993603; Order_Code_RS: N/A
U27 = MCD-02000: MPU, ARM Cortex-A35 + M33 32-bit MPU, 808KB RAM, With Crypto; Part_Type: IC; Part_Preference: Recommended; Manufacturer: STMICROELECTRONICS; Manufacturer_HQ_COO: EU; Component_Country_Of_Origin: Unknown; ShowFields: YES; ID: 4100; Internal_Part_Number: MCD-02000; Value: STM32MP257FAI3; Status: Checked; Manufacturer_Part_Number: STM32MP257FAI3; Package: LFBGA-436; ComponentLink1URL: http://tunmcdsvn.tun.st.com/Component_Documentation_Library/Trunk/IC/STMICROELECTRONICS_STM32MP257FAI3; Order_Code_Digikey: N/A; Order_Code_Farnell: N/A; Order_Code_RS: N/A

## Sheet SDcard_eMMC.SchDoc: SDcard_eMMC
size A3; Date: Not used; ApprovedBy: Not used; CheckedBy: Not used; Author: Not used; CompanyName: STMicroelectronics; DrawnBy: Not used; Engineer: Not used; Organization: Not used; Address1: Not used; Address2: Not used; Address3: Not used; Address4: Not used; DocumentNumber: Not used; Revision: Not used; SheetNumber: 13; SheetTotal: 18; CurrentTime: Not used; CurrentDate: Not used; Time: Not used; DocumentFullPathAndName: Not used; DocumentName: Not used; ModifiedDate: Not used; ImagePath: Not used; ProjectName: Not used; Application_BuildNumber: Not used
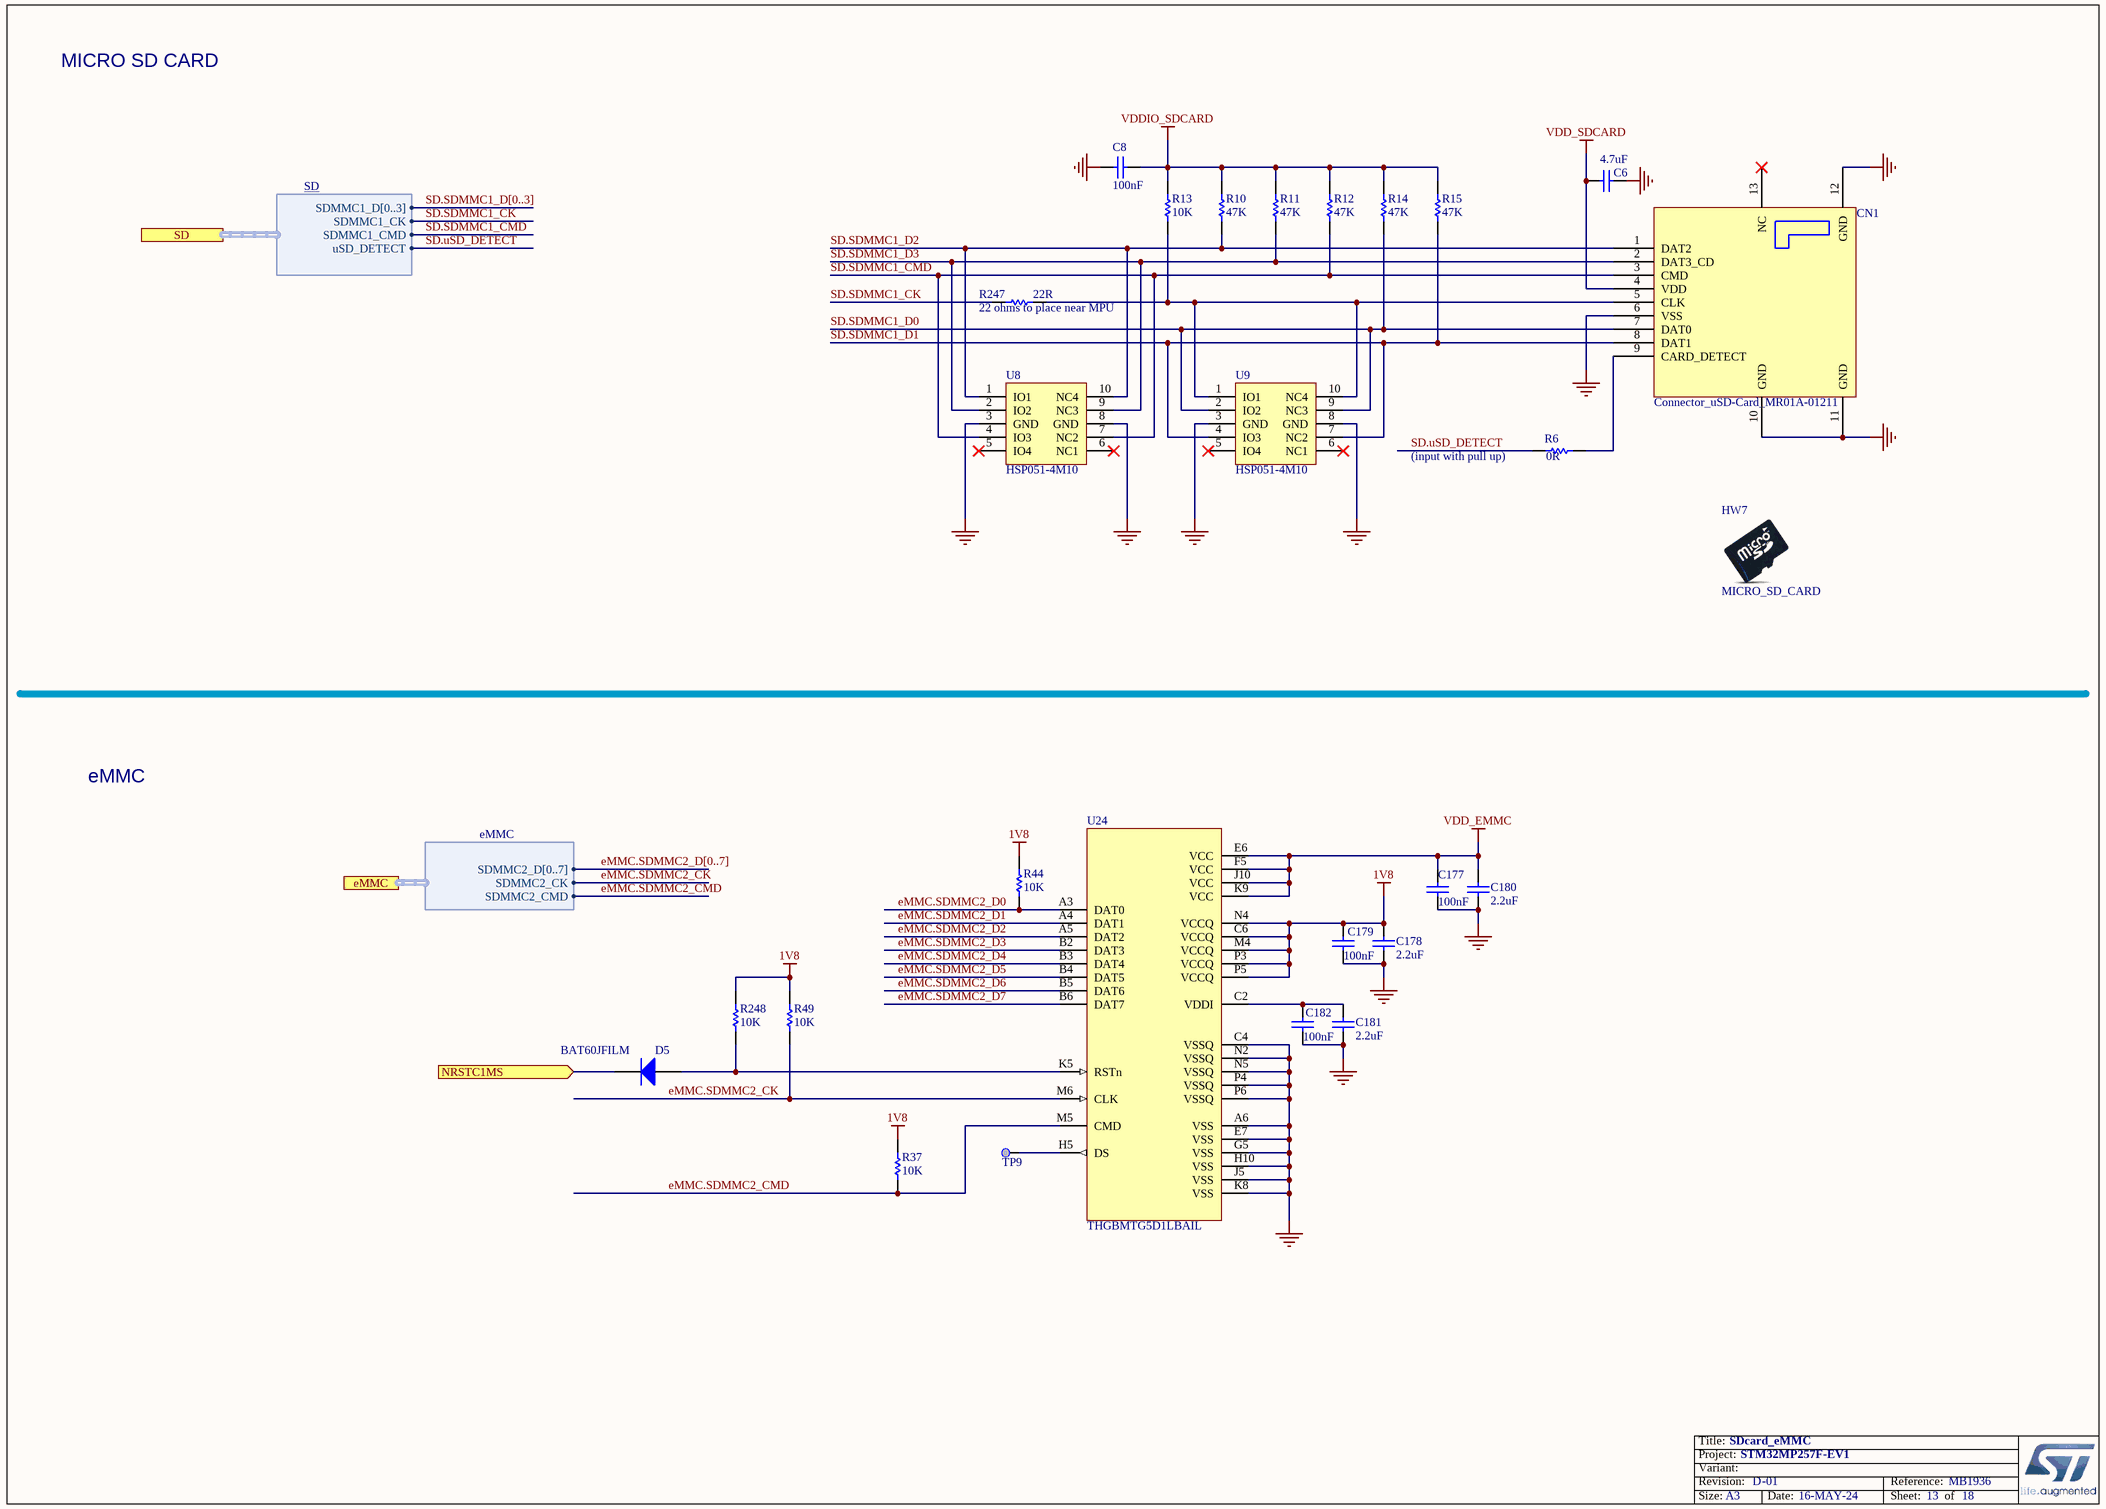
[diagram p3: SDcard_eMMC.SchDoc]

### Parts
C6  value 4.7uF  [C0402]  (hidden comment: Capacitor)
C8  value 100nF  [C0402]  (hidden comment: Capacitor)
C177  value 100nF  [C0402]  (hidden comment: Capacitor)
C178  value 2.2uF  [C0402]  (hidden comment: Capacitor)
C179  value 100nF  [C0402]  (hidden comment: Capacitor)
C180  value 2.2uF  [C0402]  (hidden comment: Capacitor)
C181  value 2.2uF  [C0402]  (hidden comment: Capacitor)
C182  value 100nF  [C0402]  (hidden comment: Capacitor)
CN1  value Connector_uSD-Card_MR01A-01211  [CON_MICROSD_ATOM_MR01A-01211]  (hidden comment: MR01A-01211)
D5  BAT60JFILM  [DIO_SOD323]
HW7  Micro_SD_card  (mechanical)
R6  value 0R  [R0402]  (hidden comment: Resistor)
R10  value 47K  [R0402]  (hidden comment: Resistor)
R11  value 47K  [R0402]  (hidden comment: Resistor)
R12  value 47K  [R0402]  (hidden comment: Resistor)
R13  value 10K  [R0402]  (hidden comment: Resistor)
R14  value 47K  [R0402]  (hidden comment: Resistor)
R15  value 47K  [R0402]  (hidden comment: Resistor)
R37  value 10K  [R0402]  (hidden comment: Resistor)
R44  value 10K  [R0402]  (hidden comment: Resistor)
R49  value 10K  [R0402]  (hidden comment: Resistor)
R247  value 22R  [R0201_H0P23]  (hidden comment: Resistor)
R248  value 10K  [R0402]  (hidden comment: Resistor)
TP9  Test Point  [TP_SMD_1MM]  (value not drawn)  (no BOM)
U8  HSP051-4M10  [ESD_UQFN-10L_2P5X1_P050]
U9  HSP051-4M10  [ESD_UQFN-10L_2P5X1_P050]
U24  value THGBMTG5D1LBAIL  [ICC_P-WFBGA153_13X11P5_P050]  (hidden comment: eMMC_THGBMTG5D1LBAIL)

### Ports
eMMC (harness eMMC), NRSTC1MS (in), SD (harness SD)

### Harnesses
SD: SDMMC1_D[0..3], SDMMC1_CK, SDMMC1_CMD, uSD_DETECT
eMMC: SDMMC2_CK, SDMMC2_CMD, SDMMC2_D[0..7]

### Nets
1V8: C178.2 C179.2 R37.2 R44.2 R49.2 R248.2 U24.C6(VCCQ) U24.M4(VCCQ) U24.N4(VCCQ) U24.P3(VCCQ) U24.P5(VCCQ)
GND: C6.1 C8.1 C177.1 C178.1 C179.1 C180.1 C181.1 C182.1 CN1.6(VSS) CN1.10(GND) CN1.11(GND) CN1.12(GND) U8.3(GND) U8.8(GND) U9.3(GND) U9.8(GND) U24.A6(VSS) U24.C4(VSSQ) U24.E7(VSS) U24.G5(VSS) U24.H10(VSS) U24.J5(VSS) U24.K8(VSS) U24.N2(VSSQ) U24.N5(VSSQ) U24.P4(VSSQ) U24.P6(VSSQ)
VDD_EMMC: C177.2 C180.2 U24.E6(VCC) U24.F5(VCC) U24.J10(VCC) U24.K9(VCC)
VDD_SDCARD: C6.2 CN1.4(VDD)
VDDIO_SDCARD: C8.2 R10.2 R11.2 R12.2 R13.2 R14.2 R15.2
eMMC.SDMMC2_CK: R49.1 U24.M6(CLK) ; port eMMC.SDMMC2_CK
eMMC.SDMMC2_CMD: R37.1 U24.M5(CMD) ; port eMMC.SDMMC2_CMD
eMMC.SDMMC2_D0: R44.1 U24.A3(DAT0)
eMMC.SDMMC2_D1: U24.A4(DAT1)
eMMC.SDMMC2_D2: U24.A5(DAT2)
eMMC.SDMMC2_D3: U24.B2(DAT3)
eMMC.SDMMC2_D4: U24.B3(DAT4)
eMMC.SDMMC2_D5: U24.B4(DAT5)
eMMC.SDMMC2_D6: U24.B5(DAT6)
eMMC.SDMMC2_D7: U24.B6(DAT7)
NRSTC1MS: D5.2(K) ; port NRSTC1MS
SD.SDMMC1_CK: R247.1 ; port SD.SDMMC1_CK
SD.SDMMC1_CMD: CN1.3(CMD) R12.1 U8.4(IO3) U8.7(NC2) ; port SD.SDMMC1_CMD
SD.SDMMC1_D0: CN1.7(DAT0) R14.1 U9.2(IO2) U9.9(NC3)
SD.SDMMC1_D1: CN1.8(DAT1) R15.1 U9.4(IO3) U9.7(NC2)
SD.SDMMC1_D2: CN1.1(DAT2) R10.1 U8.1(IO1) U8.10(NC4)
SD.SDMMC1_D3: CN1.2(DAT3_CD) R11.1 U8.2(IO2) U8.9(NC3)
SD.uSD_DETECT: R6.1 ; port SD.uSD_DETECT
NetC181_2: C181.2 C182.2 U24.C2(VDDI)
NetCN1_5: CN1.5(CLK) R13.1 R247.2 U9.1(IO1) U9.10(NC4)
NetCN1_9: CN1.9(CARD_DETECT) R6.2
NetD5_1: D5.1(A) R248.1 U24.K5(RSTn)
NetTP9_1: TP9.1 U24.H5(DS)

Not connected (* = marked no-connect by the designer): CN1 13(NC)*; U8 5(IO4)* 6(NC1)*; U9 5(IO4)* 6(NC1)*

### Buses and harness runs
bus eMMC.SDMMC2_D[0..7]
bus SD.SDMMC1_D[0..3]

### Notes on the sheet
- MICRO SD CARD
- (near R247) 22 ohms to place near MPU
- (near R6) (input with pull up)
- eMMC
- Title:
- Project:
- Size:
- Revision:
- Variant:
- A3
- -
- Date:
- Reference:
- Sheet:
- of

### Library data of the parts
C6 = MCD-01356: Capacitor, MLCC, 4.7uF, 6V3, X5R, 20%, 0402, T=0,5mm; Manufacturer_Part_Number: GRM155R60J475ME47; Manufacturer: MURATA; Alternate_Manufacturer_Part_Number: GRM155R60J475ME87; Part_Preference: Recommended; Provided_By: SUBCO; ECCN_EU: NEC; ECCN_US: EAR99; Order_Code_RS: 814-5230; Component_Country_Of_Origin: Japan; ID: 3456; ShowFields: YES; Internal_Part_Number: MCD-01356; Status: Released; Part_Type: Capacitor; Package: 0402; ComponentLink1Description: Datasheet; ComponentLink1URL: http://tunmcdsvn.tun.st.com/Component_Documentation_Library/Trunk/Capacitor/MURATA_GRM_Series; Alternate_Manufacturer: MURATA; Order_Code_Digikey: 490-5915-1-ND; Order_Code_Farnell: 2666407
C8 C177 C179 C182 = MCD-00006: Capacitor, MLCC, 100nF, 16V, X7R, +/-10%, 0402, T=0.5mm; Part_Preference: Recommended; Manufacturer: YAGEO; Manufacturer_Part_Number: CC0402KRX7R7BB104; Alternate_Manufacturer: MURATA; Alternate_Manufacturer_Part_Number: GCM155R71C104KA55D; Order_Code_RS: 616-9701; Component_Country_Of_Origin: China; ID: 2474; ShowFields: YES; Internal_Part_Number: MCD-00006; Status: Released; Part_Type: Capacitor; Package: 0402; ComponentLink1Description: Datasheet; ComponentLink1URL: http://tunmcdsvn.tun.st.com/Component_Documentation_Library/Trunk/Capacitor/YAGEO_X7R_Series; Order_Code_Digikey: 311-1338-1-ND; Order_Code_Farnell: 9402047
C178 C180 C181 = MCD-02606: Capacitor, MLCC, 2.2uF, 6.3V, X5R, +/-10%, 0402, T=0.5mm; Part_Preference: Recommended; Manufacturer: YAGEO; Manufacturer_Part_Number: CC0402KRX5R5BB225; Order_Code_RS: 1992205; ShowFields: YES; ID: 4712; Internal_Part_Number: MCD-02606; Status: New; Part_Type: Capacitor; Package: 0402; ComponentLink1URL: http://tunmcdsvn.tun.st.com/Component_Documentation_Library/Trunk/Capacitor/YAGEO_X5R_Series; Order_Code_Digikey: 311-1682-2-ND; Order_Code_Farnell: 3366429
CN1 = MCD-00653: Connector_uSD Card, Top Mnt Push-Push; Part_Preference: Recommended; Manufacturer: ATOM; Component_Country_Of_Origin: Unknown; ShowFields: YES; ID: 3087; Internal_Part_Number: MCD-00653; Status: Released; Part_Type: Connector; Manufacturer_Part_Number: MR01A-01211; ComponentLink1URL: http://tunmcdsvn.tun.st.com/Component_Documentation_Library/Trunk/Connector/ATOM_MR01A-01211/; Order_Code_Digikey: N/A; Order_Code_Farnell: N/A; Order_Code_RS: N/A
D5 = MCD-00034: BMS_Part_Number: 9151097; Part_Type: Diode; Part_Preference: Recommended; Manufacturer: STMICROELECTRONICS; Manufacturer_HQ_COO: EU; Component_Country_Of_Origin: China; ShowFields: YES; ID: 2483; Internal_Part_Number: MCD-00034; Value: BAT60JFILM; Status: Released; Manufacturer_Part_Number: BAT60JFILM; ComponentLink1URL: http://tunmcdsvn.tun.st.com/Component_Datasheet_Library/Trunk/Diodes/STM_Diode_BAT60JFILM-SOD323
HW7 = MCD-03307: MICRO_SD_CARD, SANDISK, 16GB, Class10, 3V; Part_Type: Mechanical; Part_Preference: Recommended; Manufacturer_Part_Number: SDSDQAD-016G; Order_Code_RS: 220-8618; ShowFields: YES; ID: 5423; Internal_Part_Number: MCD-03307; Value: MICRO_SD_CARD; Status: New; Manufacturer: SANDISK; Package: N/A; ComponentLink1URL: http://tunmcdsvn.tun.st.com/Component_Documentation_Library/Trunk/Mechanical/SANDISK_SDSDQAD-016G; Order_Code_Digikey: N/A; Order_Code_Farnell: N/A
R6 = MCD-00052: Resistor,0R,0402,5%,1/16W; Manufacturer_Part_Number: RC0402JR-070RL; Manufacturer: YAGEO; Part_Preference: Recommended; ECCN_US: EAR99; ECCN_EU: NEC; Provided_By: SUBCO; Order_Code_RS: 618-5804; Component_Country_Of_Origin: China; ID: 2540; ShowFields: YES; Internal_Part_Number: MCD-00052; ComponentLink1Description: Datasheet; Status: Released; Part_Type: Resistor; ComponentLink1URL: http://tunmcdsvn.tun.st.com/Component_Documentation_Library/Trunk/Resistor/YAGEO_RC_L_Series; Package: 0402; Alternate_Manufacturer: N/A; Alternate_Manufacturer_Part_Number: N/A; Order_Code_Digikey: 311-0.0JRCT-ND; Order_Code_Farnell: 9232516RL
R10-R12 R14 R15 = MCD-00063: Resistor,47K,0402,1%,1/16W; Manufacturer_Part_Number: RC0402FR-0747KL; Manufacturer: YAGEO; Part_Preference: Recommended; ECCN_US: EAR99; ECCN_EU: NEC; Provided_By: SUBCO; Component_Country_Of_Origin: China; ID: 2528; ShowFields: YES; Internal_Part_Number: MCD-00063; ComponentLink1Description: Datasheet; Status: Released; Part_Type: Resistor; ComponentLink1URL: http://tunmcdsvn.tun.st.com/Component_Documentation_Library/Trunk/Resistor/YAGEO_RC_L_Series; Package: 0402; Alternate_Manufacturer: N/A; Alternate_Manufacturer_Part_Number: N/A; Order_Code_Digikey: 311-47.0KLRCT-ND; Order_Code_Farnell: 9239430; Order_Code_RS: N/A
R13 R37 R44 R49 R248 = MCD-00053: Resistor,10K,0402,1%,1/16W; Manufacturer_Part_Number: RC0402FR-0710KL; Manufacturer: YAGEO; BMS_Part_Number: 9131590; Part_Preference: Recommended; ECCN_US: EAR99; ECCN_EU: NEC; Provided_By: SUBCO; Component_Country_Of_Origin: China; ID: 2539; ShowFields: YES; Internal_Part_Number: MCD-00053; ComponentLink1Description: Datasheet; Status: Released; Part_Type: Resistor; ComponentLink1URL: http://tunmcdsvn.tun.st.com/Component_Documentation_Library/Trunk/Resistor/YAGEO_RC_L_Series; Package: 0402; Order_Code_Digikey: 311-10.0KLRCT-ND; Order_Code_Farnell: 9239359; Order_Code_RS: N/A
  R13: Alternate_Manufacturer: N/A; Alternate_Manufacturer_Part_Number: N/A
R247 = MCD-02978: Resistor, 22R, 0201, +/-1%, 1/20W; Manufacturer_Part_Number: RC0201FR-0722RL; Manufacturer: YAGEO; Part_Preference: Recommended; Order_Code_RS: 198-7593; ID: 5094; ShowFields: YES; Internal_Part_Number: MCD-02978; Status: New; Part_Type: Resistor; ComponentLink1URL: http://tunmcdsvn.tun.st.com/Component_Documentation_Library/Trunk/Resistor/YAGEO_RC_L_Series; Package: 0201; Order_Code_Digikey: YAG2518TR-ND; Order_Code_Farnell: 2693564
TP9 = MCD-00074: Test Point 1mm; Part_Type: Misc; Part_Preference: Recommended; ID: 2518; ShowFields: YES; Internal_Part_Number: MCD-00074; Status: Released; Manufacturer_Part_Number: n/a; Manufacturer: n/a; ComponentLink1Description: Datasheet; ComponentLink1URL: http://na; ECCN_US: n/a; ECCN_EU: n/a; Provided_By: n/a; Order_Code_Digikey: N/A; Order_Code_Farnell: N/A; Order_Code_RS: N/A
U8 U9 = MCD-00667: 4-line ESD protection for high speed lines; Part_Type: Diode; Manufacturer: STMICROELECTRONICS; BMS_Part_Number: 9179041; Manufacturer_HQ_COO: EU; Part_Preference: Recommended; ECCN_US: EAR99; ECCN_EU: NEC; Provided_By: SUBCO with ST control; Component_Country_Of_Origin: Philippines; ID: 3081; ShowFields: YES; Internal_Part_Number: MCD-00667; Value: HSP051-4M10; Status: Released; Manufacturer_Part_Number: HSP051-4M10; Package: uQFN-10L; ComponentLink1Description: Datasheet; ComponentLink1URL: http://tunmcdsvn.tun.st.com/Component_Datasheet_Library/Trunk/Diodes/STM_ESD_HSP051-4M10
U24 = MCD-02799: Memory, eMMC, 4GB, 15nm ,WFBGA , 153 pins; Part_Type: IC; Part_Preference: Recommended; Manufacturer: KIOXIA; ShowFields: YES; ID: 4911; Internal_Part_Number: MCD-02799; Status: New; Manufacturer_Part_Number: THGBMTG5D1LBAIL; Package: WFBGA153; ComponentLink1URL: http://tunmcdsvn.tun.st.com/Component_Documentation_Library/Trunk/IC/KIOXIA_THGBMTG5D1LBAIL; Order_Code_Digikey: N/A; Order_Code_Farnell: N/A; Order_Code_RS: N/A